# EasyEDA Pro project ProPrj_FOC_STM32F446.epro, schematic schematic1

## Sheets
1 电源: Board Name: Board1
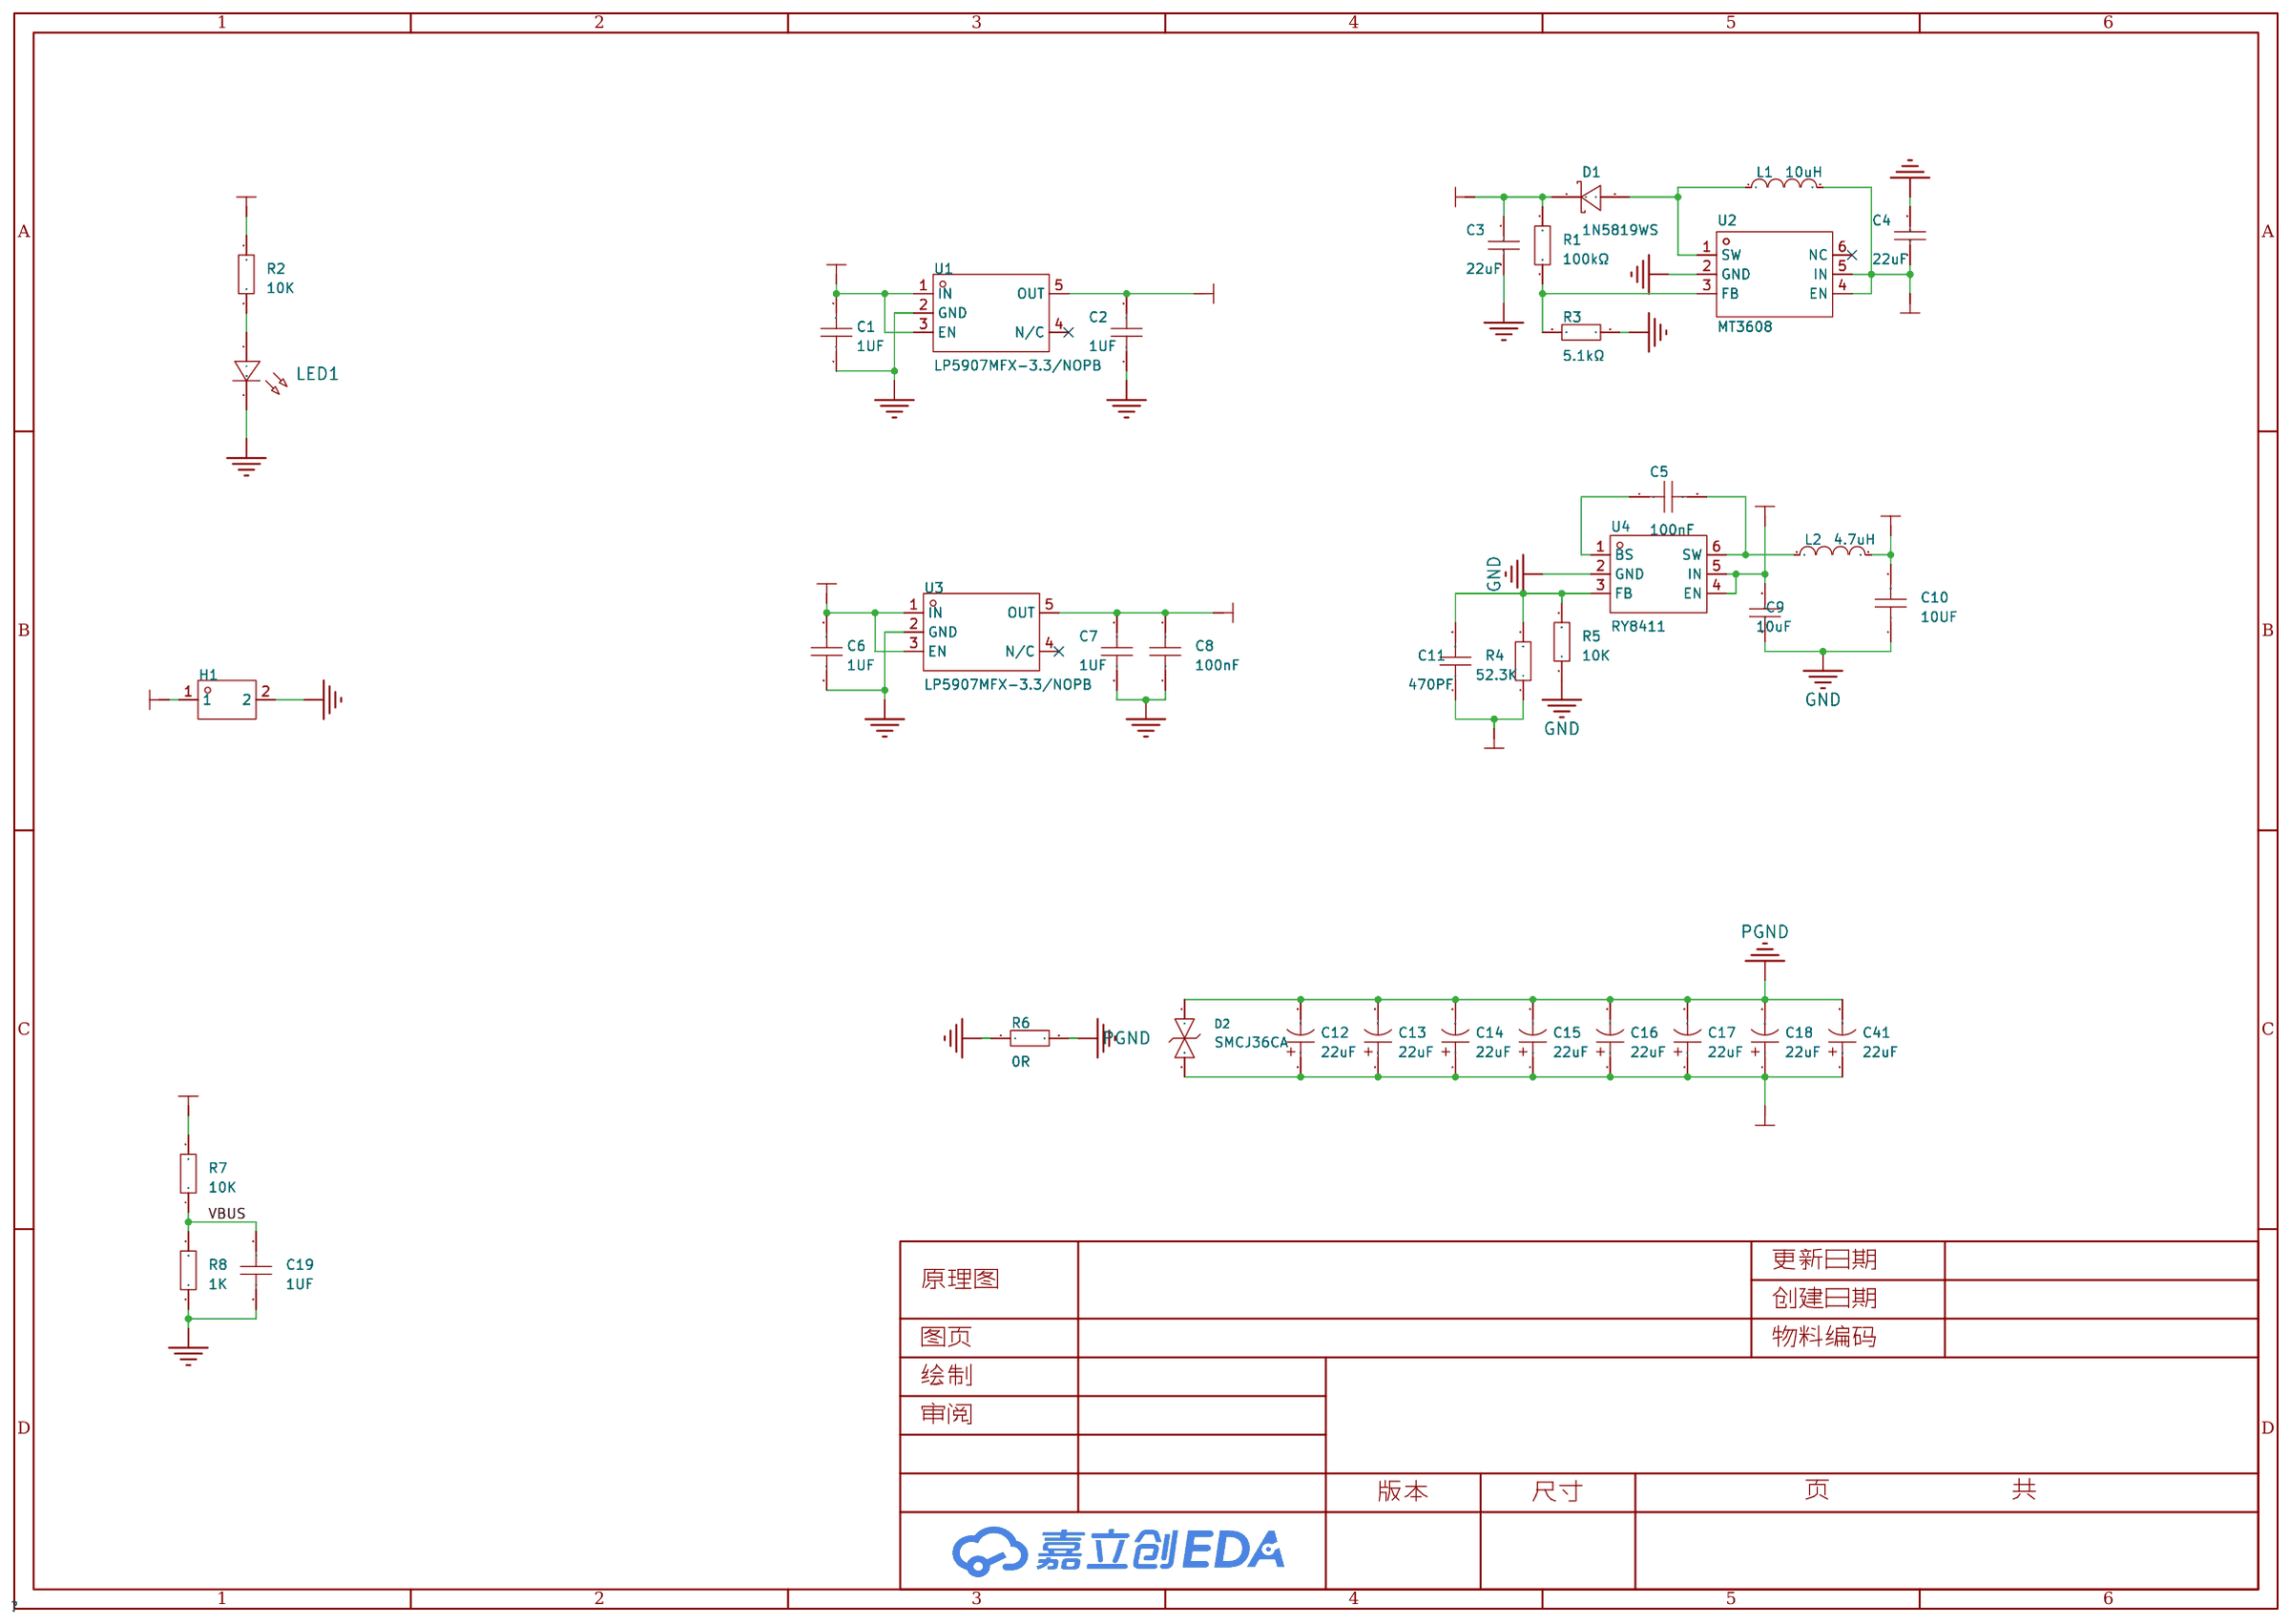
[diagram p0: 电源]
2 驱动: Create Date: 2023-12-28; Page Name: 驱动; Project Name: MY_FOC; Schematic Name: Schematic1; Update Date: 2024-01-11; Company: 嘉立创EDA; Page Size: A4; Version: V1.0
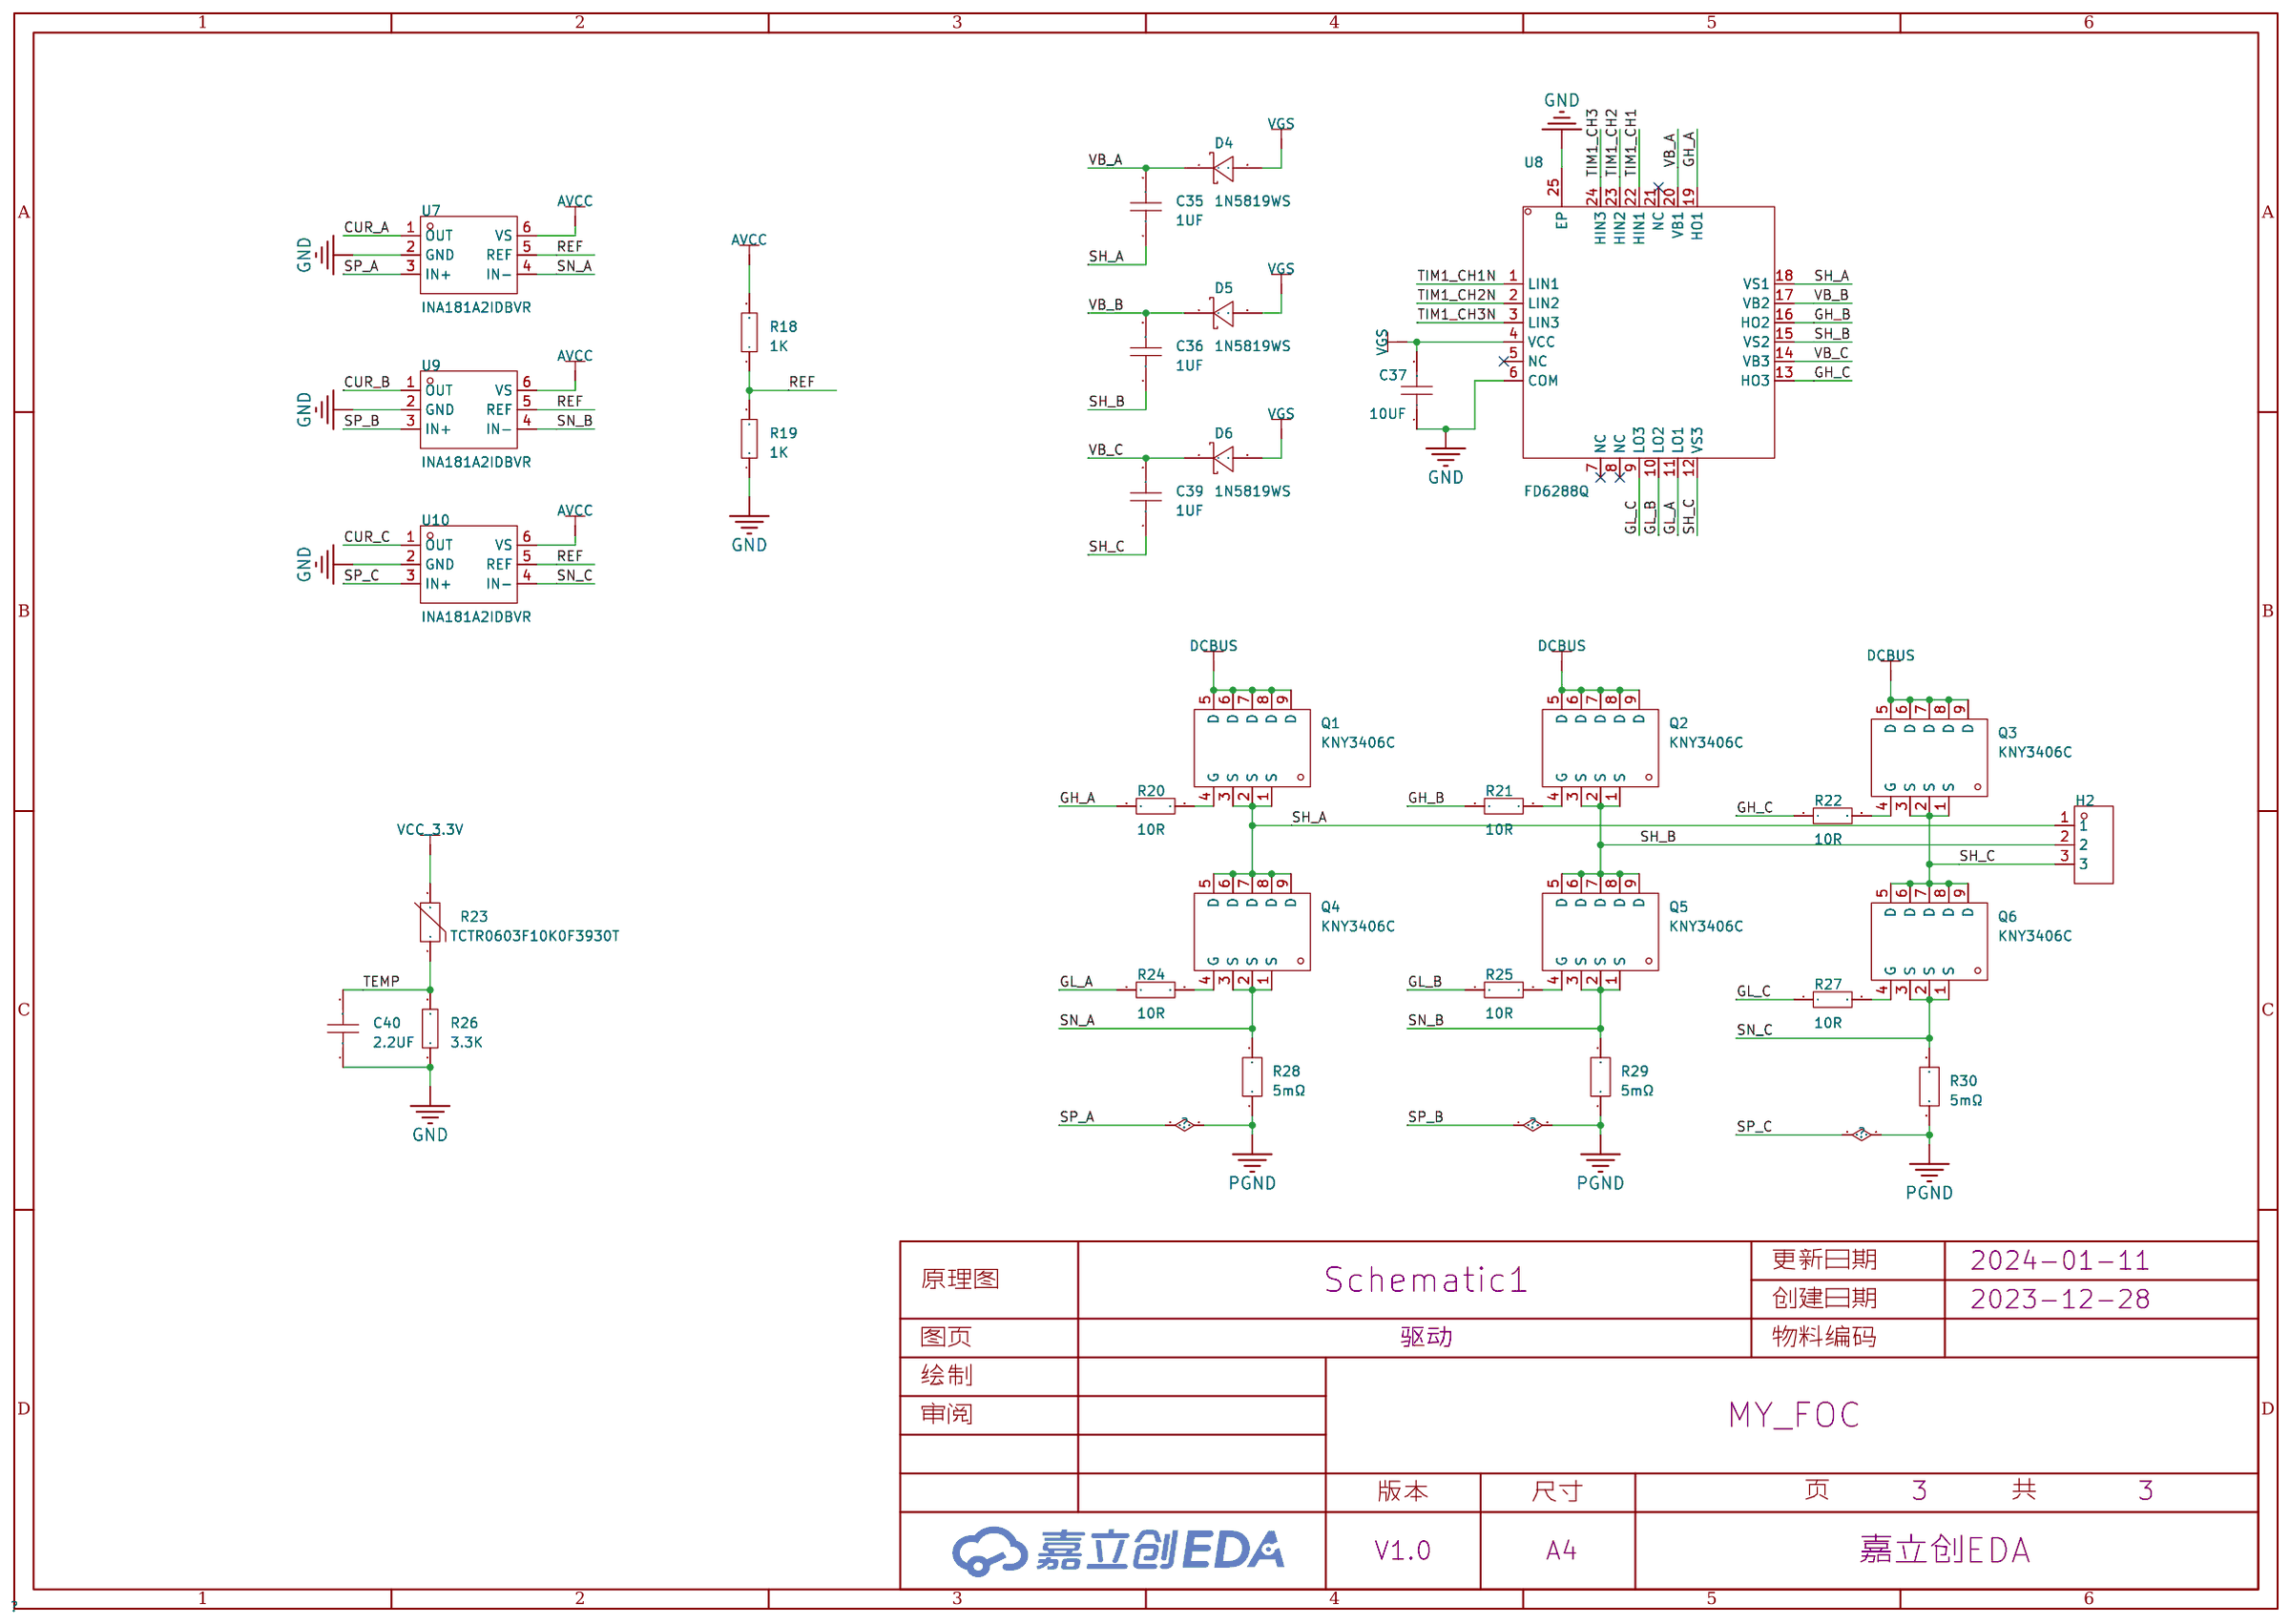
[diagram p1: 驱动]
3 主控: Create Date: 2023-12-28; Page Name: 主控; Project Name: MY_FOC; Schematic Name: Schematic1; Update Date: 2024-01-12; Company: 嘉立创EDA; Page Size: A4; Version: V1.0
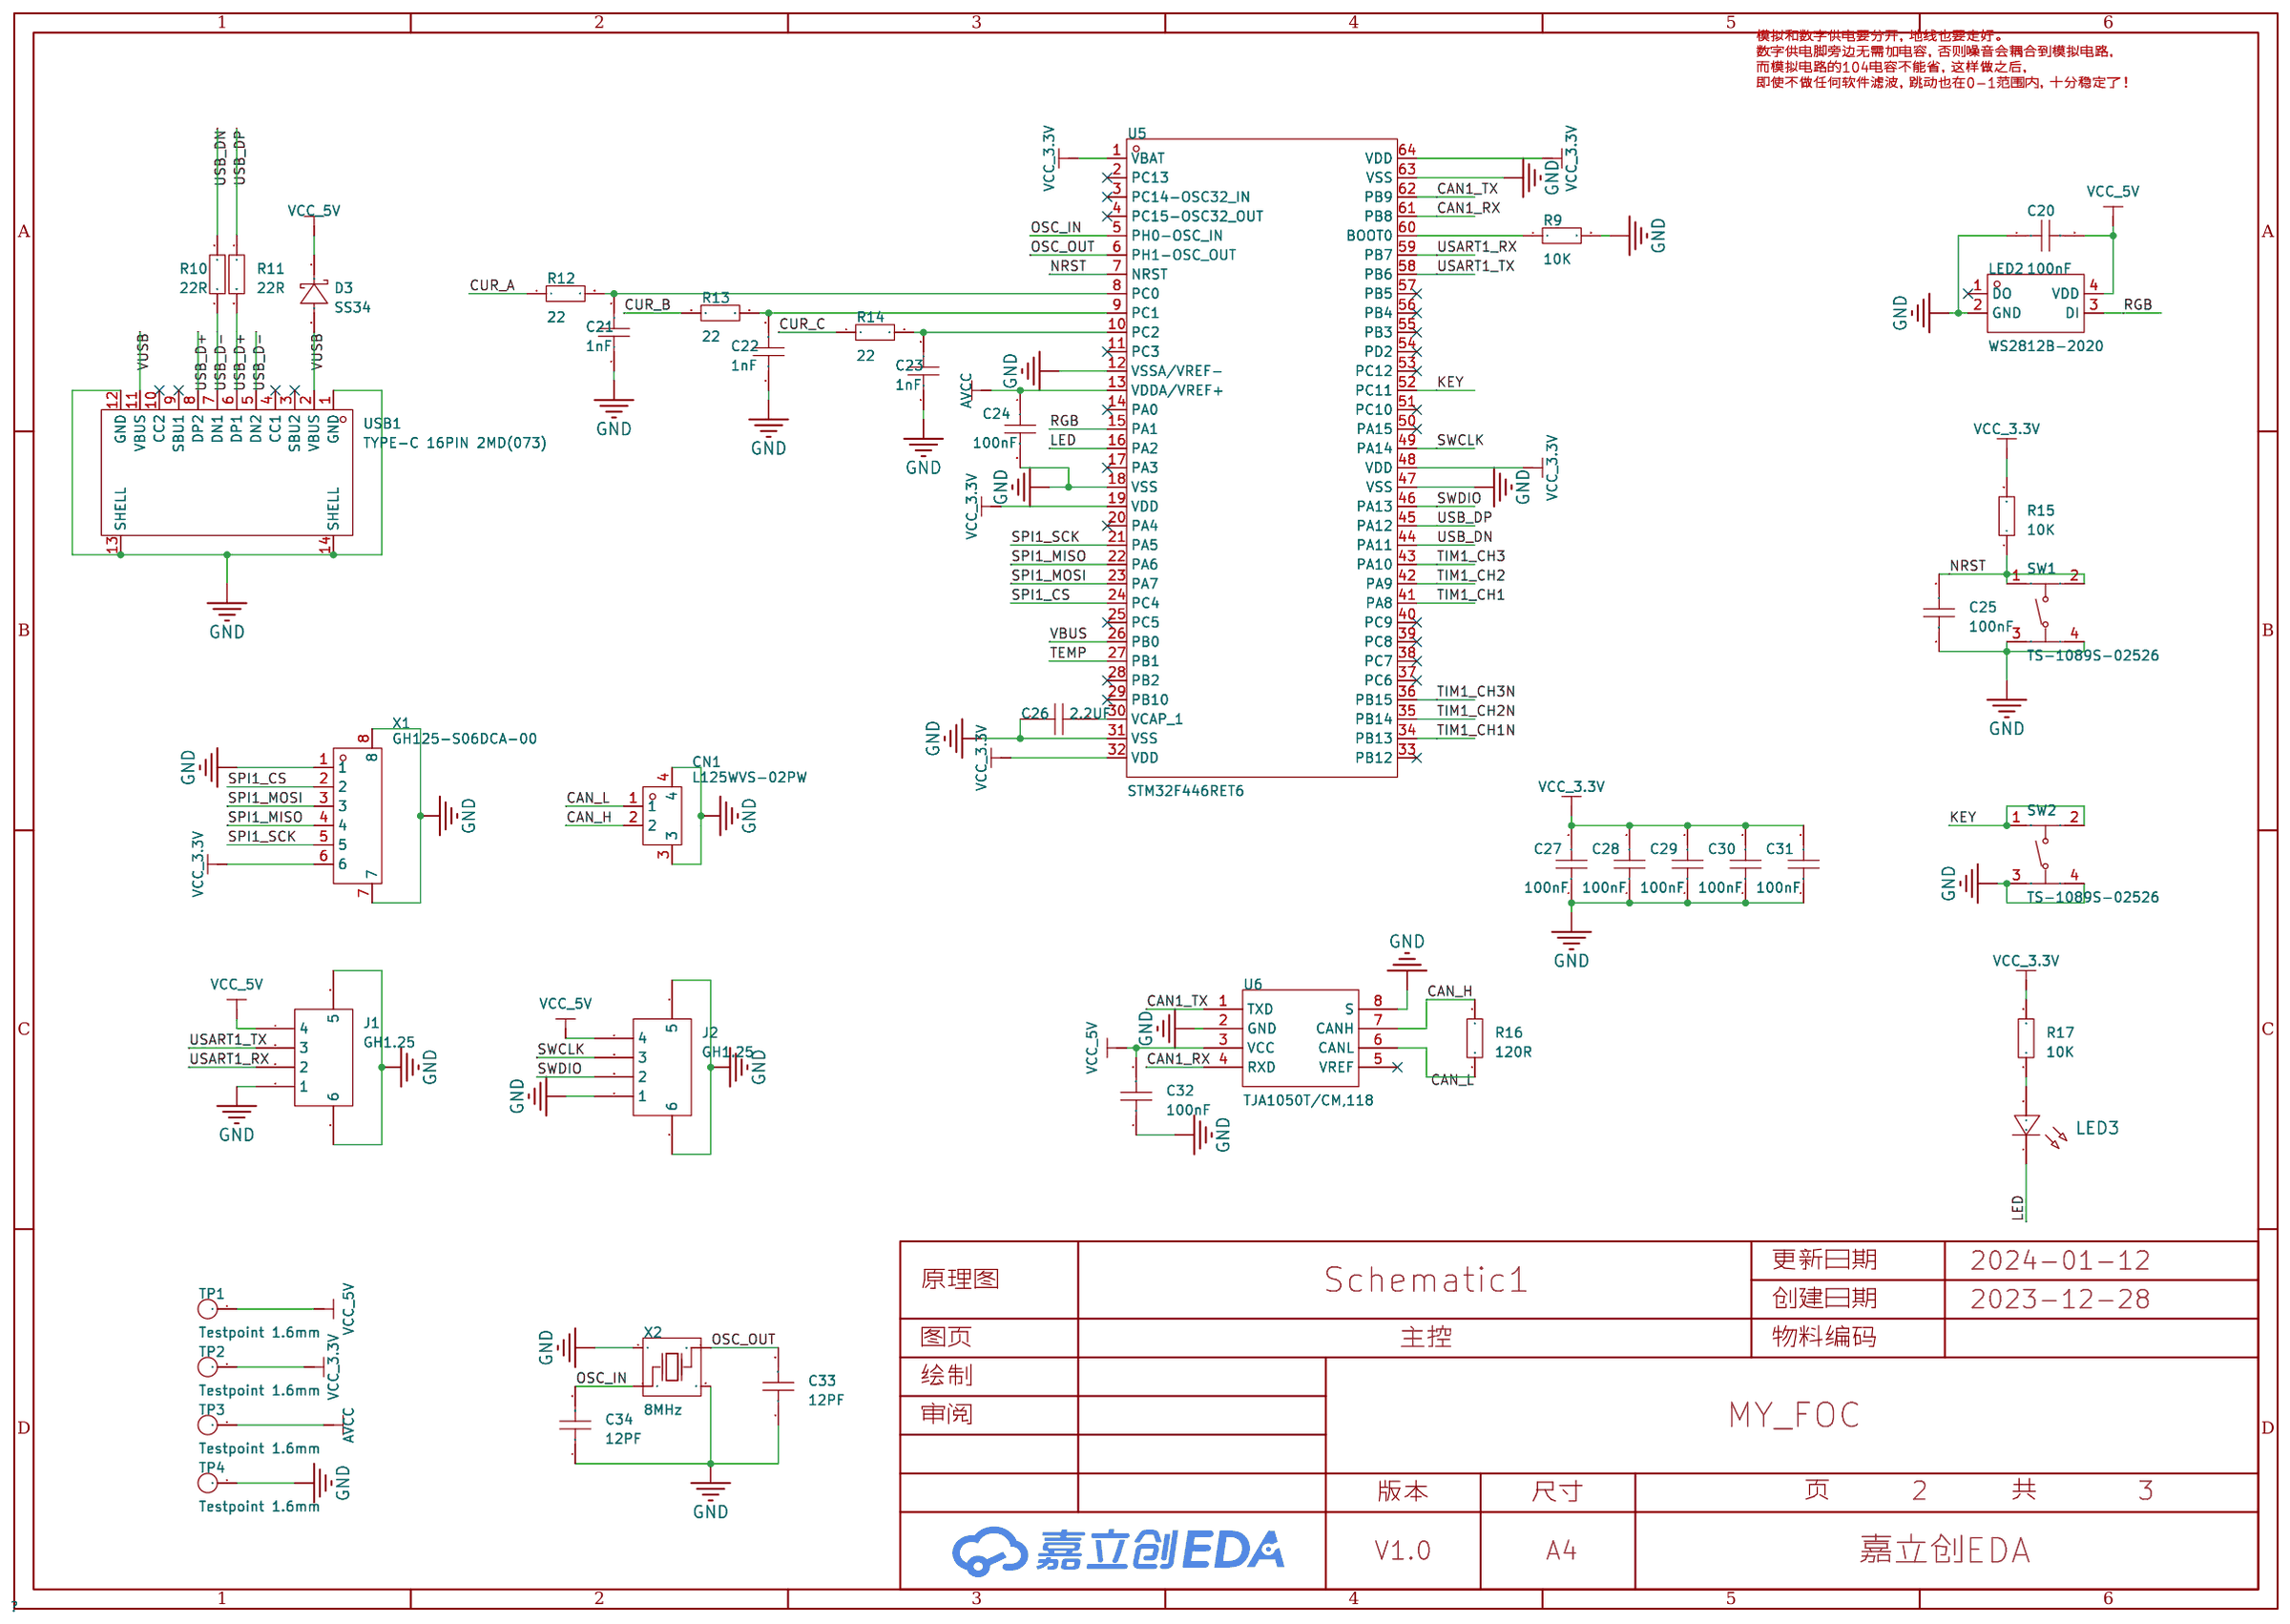
[diagram p2: 主控]

## Parts
sheet 主控
C20  100nF  [C0603]
C21  1nF  [C0603]
C22  1nF  [C0603]
C23  1nF  [C0603]
C24  100nF  [C0603]
C25  100nF  [C0603]
C26  2.2UF  [C0603]
C27  100nF  [C0603]
C28  100nF  [C0603]
C29  100nF  [C0603]
C30  100nF  [C0603]
C31  100nF  [C0603]
C32  100nF  [C0603]
C33  12PF  [C0603]
C34  12PF  [C0603]
CN1  L125WVS-02PW  [CONN-SMD_2P-P1.25_DELON_L125WVS-02PW]
D3  SS34  [SMA_L4.3-W2.5-LS5.0-RD]
J1  GH1.25  [CONN-SMD_4P-P1.25_JS_GH125-S04CCA-00]
J2  GH1.25  [CONN-SMD_4P-P1.25_JS_GH125-S04CCA-00]
LED2  WS2812B-2020  [LED-SMD_4P-L2.0-W2.0-TL_WS2812B-2020]
LED3  -  [LED_0603]
R9  10K  [R0603]
R10  22R  [R0603]
R11  22R  [R0603]
R12  22  [R0603]
R13  22  [R0603]
R14  22  [R0603]
R15  10K  [R0603]
R16  120R  [R0603]
R17  10K  [R0603]
SW1  TS-1089S-02526  [SW-SMD_4P-L4.2-W3.3-P2.15-LS5.1]
SW2  TS-1089S-02526  [SW-SMD_4P-L4.2-W3.3-P2.15-LS5.1]
TP1  Testpoint 1.6mm  [TESTPOINT 1.6MM]
TP2  Testpoint 1.6mm  [TESTPOINT 1.6MM]
TP3  Testpoint 1.6mm  [TESTPOINT 1.6MM]
TP4  Testpoint 1.6mm  [TESTPOINT 1.6MM]
U5  STM32F446RET6  [LQFP-64_L10.0-W10.0-P0.50-LS12.0-BL]
U6  TJA1050T/CM,118  [SOIC-8_L5.0-W4.0-P1.27-LS6.0-BL]
USB1  TYPE-C 16PIN 2MD(073)  [USB-C-SMD_TYPE-C-6PIN-2MD-073]
X1  GH125-S06DCA-00  [CONN-SMD_6P-P1.25_JUSHUO_GH125-S06DCA-00]
X2  8MHz  [OSC-SMD_4P-L3.2-W2.5-BL]
sheet 电源
C1  1UF  [C0603]
C2  1UF  [C0603]
C3  22uF  [C1206]
C4  22uF  [C1206]
C5  100nF  [C0603]
C6  1UF  [C0603]
C7  1UF  [C0603]
C8  100nF  [C0603]
C9  10uF  [C1206]
C10  10UF  [C0603]
C11  470PF  [C0603]
C12  22uF  [CAP-SMD_L3.2-W1.6-FD]
C13  22uF  [CAP-SMD_L3.2-W1.6-FD]
C14  22uF  [CAP-SMD_L3.2-W1.6-FD]
C15  22uF  [CAP-SMD_L3.2-W1.6-FD]
C16  22uF  [CAP-SMD_L3.2-W1.6-FD]
C17  22uF  [CAP-SMD_L3.2-W1.6-FD]
C18  22uF  [CAP-SMD_L3.2-W1.6-FD]
C19  1UF  [C0603]
C41  22uF  [CAP-SMD_L3.2-W1.6-FD]
D1  1N5819WS  [SOD-323_L1.8-W1.3-LS2.5-RD]
D2  SMCJ36CA  [SMC_L7.2-W5.8-LS8.1-BI]
H1  -  [HDR-TH_2P-P2.54-V-M-2]
L1  10uH  [IND-SMD_L2.5-W2.0_FNR252012S]
L2  4.7uH  [IND-SMD_L2.5-W2.0_FNR252012S]
LED1  -  [LED_0603]
R1  100kΩ  [R0603]
R2  10K  [R0603]
R3  5.1kΩ  [R0603]
R4  52.3K  [R0603]
R5  10K  [R0603]
R6  0R  [R0603]
R7  10K  [R0603]
R8  1K  [R0603]
U1  LP5907MFX-3.3/NOPB  [SOT-23-5_L3.0-W1.7-P0.95-LS2.8-BR]
U2  MT3608  [SOT-23-6_L2.9-W1.6-P0.95-LS2.8-BL]
U3  LP5907MFX-3.3/NOPB  [SOT-23-5_L3.0-W1.7-P0.95-LS2.8-BR]
U4  RY8411  [SOT-23-6_L2.9-W1.6-P0.95-LS2.8-TL]
sheet 驱动
C35  1UF  [C0603]
C36  1UF  [C0603]
C37  10UF  [C0603]
C39  1UF  [C0603]
C40  2.2UF  [C0603]
D4  1N5819WS  [SOD-323_L1.8-W1.3-LS2.5-RD]
D5  1N5819WS  [SOD-323_L1.8-W1.3-LS2.5-RD]
D6  1N5819WS  [SOD-323_L1.8-W1.3-LS2.5-RD]
H2  -  [HDR-TH_3P-P2.54-V-M]
Q1  KNY3406C  [PDFN-8_L4.9-W5.8-P1.27-LS6.1-BL]
Q2  KNY3406C  [PDFN-8_L4.9-W5.8-P1.27-LS6.1-BL]
Q3  KNY3406C  [PDFN-8_L4.9-W5.8-P1.27-LS6.1-BL]
Q4  KNY3406C  [PDFN-8_L4.9-W5.8-P1.27-LS6.1-BL]
Q5  KNY3406C  [PDFN-8_L4.9-W5.8-P1.27-LS6.1-BL]
Q6  KNY3406C  [PDFN-8_L4.9-W5.8-P1.27-LS6.1-BL]
R18  1K  [R0603]
R19  1K  [R0603]
R20  10R  [R0603]
R21  10R  [R0603]
R22  10R  [R0603]
R23  TCTR0603F10K0F3930T  [R0603]
R24  10R  [R0603]
R25  10R  [R0603]
R26  3.3K  [R0603]
R27  10R  [R0603]
R28  5mΩ  [RES-SMD_L6.4-W3.2-1]
R29  5mΩ  [RES-SMD_L6.4-W3.2-1]
R30  5mΩ  [RES-SMD_L6.4-W3.2-1]
U7  INA181A2IDBVR  [SOT-23-6_L2.9-W1.6-P0.95-LS2.8-BL]
U8  FD6288Q  [QFN-24_L4.0-W4.0-P0.50-BL-EP2.6]
U9  INA181A2IDBVR  [SOT-23-6_L2.9-W1.6-P0.95-LS2.8-BL]
U10  INA181A2IDBVR  [SOT-23-6_L2.9-W1.6-P0.95-LS2.8-BL]

## Library data of the parts
C1 C2 C5-C8 C10 C11 C19-C37 C39 C40 = CAP_0603: Supplier Footprint: 0603
CN1 = L125WVS-02PW: 插针结构:1x2P;间距:1.25mm;公母:公;安装方式:卧贴;排数:1;每排PIN数:2;额定电流:1A;工作温度范围:-40℃~+110℃;; LCSC Part Name: 1x2P 间距:1.25mm 卧贴 GH1.25间距卧式贴片 2P 连接器; Supplier Part: C2998790; Manufacturer: DEALON(德艺隆); Supplier Footprint: SMD,P=1.25mm; JLCPCB Part Class: 扩展库; Datasheet: https://atta.szlcsc.com/upload/public/pdf/source/20220425/50B09E6409C3A2782C6D65104D18E34A.pdf; Supplier: LCSC; Pins Structure: 1x2P; Pitch: 1.25mm; Gender: 公; Mounting Style: 卧贴; Number of Rows: 1; Number of PINs Per Row: 2; Current Rating (Max): 1A; Operating Temperature Range: -40℃~+110℃
D3 = SS34_C727060: 二极管配置:独立式;正向压降(Vf):550mV@3A;直流反向耐压(Vr):40V;平均整流电流(Io):3A;; LCSC Part Name: 电压:40V 电流:3A; Supplier Part: C727060; Manufacturer: TWGMC(台湾迪嘉); Supplier Footprint: SMA(DO-214AC); JLCPCB Part Class: 扩展库; Datasheet: https://atta.szlcsc.com/upload/public/pdf/source/20200828/C727059_6599B6CAC5F3238B9C33E46794659DBE.pdf; Supplier: LCSC; Diode Configuration: 独立式; Forward Voltage (Vf@If): 550mV@3A; Reverse Voltage (Vr): 40V; Average Rectified Current (Io): 3A; Reverse Leakage Current (Ir): 500uA@40V
J1 J2 = GH1.25
LED2 = WS2812B-2020: 发光颜色:RGB三色;二极管配置:-;功率:-;透镜颜色:-;主波长:470.4nm；622.5nm；515.6nm;色温:-;发光角度:-;安装方式:-;工作温度:-;; LCSC Part Name: RGB三色 （注意防潮，请查阅规格书中对应具体内容）; Supplier Part: C965555; Manufacturer: worldsemi; Supplier Footprint: SMD,2x2mm; JLCPCB Part Class: 扩展库; Datasheet: https://atta.szlcsc.com/upload/public/pdf/source/20201203/C965555_5C919C4B6231E6ADE06011FB0D94282B.pdf; Supplier: LCSC; Emitted Color: RGB三色; Forward Current: 12mA; Dominant Wavelength: 470.4nm；622.5nm；515.6nm
LED1 LED3 = LED_0603-R: Supplier Footprint: 0603
R2 R4-R22 R24-R27 = Res_0603: Supplier Footprint: 0603
SW1 SW2 = TS-1089S-02526: 触点电流:50mA;额定电压(DC):12V;电路结构:单刀单掷;安装方式:立贴;带灯:-;机械寿命:-;; LCSC Part Name: 4.2*3.25*2.5mm 立贴 轻触开关; Supplier Part: C455282; Manufacturer: XUNPU(讯普); Supplier Footprint: SMD,3.3x4.2mm; JLCPCB Part Class: 扩展库; Datasheet: https://atta.szlcsc.com/upload/public/pdf/source/20191118/C455282_2E86A26A9CC4FEF4662951C4D45ED672.pdf; Supplier: LCSC; Contact Current: 50mA; Voltage Rating (DC): 12V; Circuit: 单刀单掷; Mounting Style: 立贴; Actuator Style: 椭圆形按钮; Switch Length: 4.2mm; Switch Width: 3.25mm; Switch Height: 2.5mm
TP1-TP4 = Testpoint 1.6mm
U5 = STM32F446RET6: CPU内核:ARM Cortex-M4;CPU最大主频:180MHz;工作电压范围:1.7V~3.6V;程序存储容量:512KB;程序存储器类型:FLASH;RAM总容量:128KB;GPIO端口数量:50;; LCSC Part Name: STM32F446RET6 MSL=3; Supplier Part: C69336; Manufacturer: ST(意法半导体); Supplier Footprint: LQFP-64(10x10); JLCPCB Part Class: Extended Part; Datasheet: https://atta.szlcsc.com/upload/public/pdf/source/20170518/1495086068896.pdf; Supplier: LCSC; CPU Core: ARM Cortex-M4; CPU Maximum Speed: 180MHz; Operating Voltage Range: 1.7V~3.6V; Program Storage Size: 512KB; Program Memory Type: FLASH; RAM Size: 128KB; GPIO Ports Number: 50; ADC (Bit): 12bit; DAC (Bit): 12bit; Universal Serial Bus: 有; Peripheral/Function: PWM；PWM；低电压检测; Watchdog: 有; Infrared Data Association: 有; Low-Voltage Detect: 有; Direct Memory Access: 有; Internal Oscillator: 有; Operating Temperature Range: -40℃~+85℃
U6 = TJA1050T/CM,118: 类型:收发器;; LCSC Part Name: 4.75V~5.25V; Supplier Part: C6952; Manufacturer: NXP(恩智浦); Supplier Footprint: SOIC-8; JLCPCB Part Class: 扩展库; Datasheet: https://atta.szlcsc.com/upload/public/pdf/source/20140411/1457707042917.pdf; Supplier: LCSC; Type: 收发器; Supply Voltage: 4.75V~5.25V; Supply Current: 50mA
USB1 = TYPE-C 16PIN 2MD(073): 连接器类型:Type-C;标准:-;公母:母;触点数量:16P;端口数量:1;安装方式:卧贴;额定电流 - 电源:5A;工作温度范围:-25℃~+85℃;; LCSC Part Name: Type-C 母 卧贴 带定位柱 不锈钢外壳 2次模顶; Supplier Part: C2765186; Manufacturer: SHOU HAN(首韩); Supplier Footprint: SMD; JLCPCB Part Class: 扩展库; Datasheet: https://atta.szlcsc.com/upload/public/pdf/source/20211123/39B17C16241EAC15C5E277BDA434118E.pdf; Supplier: LCSC; Connector Type: Type-C; Gender: 母; Number of Contacts: 16P; Number of Ports: 1; Mounting Style: 卧贴; Current Rating - Power (Max): 5A; Operating Temperature Range: -25℃~+85℃
X1 = GH125-S06DCA-00: 插针结构:1x6P;间距:1.25mm;公母:公;安装方式:卧贴;行距:-;排数:1;每排PIN数:6;参考系列:GH;额定电流:1A;工作温度范围:-25℃~+85℃;; LCSC Part Name: 1x6P 间距:1.25mm 卧贴 系列:GH 带扣; Supplier Part: C2886769; Manufacturer: JS(钜硕电子); Supplier Footprint: SMD,P=1.25mm; JLCPCB Part Class: 扩展库; Datasheet: https://atta.szlcsc.com/upload/public/pdf/source/20210818/CD11791E5ED3EDF45A7009E9C8A2BD4C.pdf; Supplier: LCSC; Pins Structure: 1x6P; Pitch: 1.25mm; Gender: 公; Mounting Style: 卧贴; Number of Rows: 1; Number of PINs Per Row: 6; Reference Series: GH; Current Rating (Max): 1A; Operating Temperature Range: -25℃~+85℃
X2 = TAXM8M4RDBCCT2T: 频率:8MHz;频率公差:±10ppm;负载电容:10pF;; LCSC Part Name: 8MHz ±10ppm 10pF; Supplier Part: C400090; Manufacturer: TAE(雅晶鑫); Supplier Footprint: SMD3225-4P; JLCPCB Part Class: 扩展库; Datasheet: https://atta.szlcsc.com/upload/public/pdf/source/20190626/C400090_CF95B89E745AFE4EF2E392EF8AC009D6.pdf; Supplier: LCSC; Crystal Type: 贴片无源晶振; Frequency Tolerance: ±10ppm; Frequency Stability: ±15ppm; Load Capacitance: 10pF; Equivalent Series Resistance (ESR): 250Ω; Operating Temperature: -40℃~+85℃
C3 C4 = CL31A106KBHNNNE: 容值:10uF;精度:±10%;额定电压:50V;材质(温度系数):X5R;; LCSC Part Name: 10uF ±10% 50V; Supplier Part: C13585; Manufacturer: SAMSUNG(三星); Supplier Footprint: 1206; JLCPCB Part Class: 基础库; Datasheet: https://atta.szlcsc.com/upload/public/pdf/source/20160103/1457707668742.pdf; Supplier: LCSC; Tolerance: ±10%; Voltage Rated: 50V; Temperature Coefficient: X5R
C9 = CL31A106KBHNNNE: 容值:10uF;精度:±10%;额定电压:50V;材质(温度系数):X5R;; LCSC Part Name: 10uF ±10% 50V; Supplier Part: C13585; Manufacturer: SAMSUNG(三星); Supplier Footprint: 1206; JLCPCB Part Class: Basic Part; Datasheet: https://atta.szlcsc.com/upload/public/pdf/source/20160103/1457707668742.pdf; Supplier: LCSC; Tolerance: ±10%; Voltage Rated: 50V; Temperature Coefficient: X5R
C12-C18 C41 = T494A106K016AT: 容值:10uF;精度:±10%;额定电压:16V;等效串联电阻:3Ω;; LCSC Part Name: 10uF ±10% 16V; Supplier Part: C1952724; Manufacturer: KEMET(基美); Supplier Footprint: 1206; JLCPCB Part Class: 扩展库; Datasheet: https://atta.szlcsc.com/upload/public/pdf/source/20201117/C918865_2EC2324DB0DED54D3EF2ACC81798626D.pdf; Supplier: LCSC; Tolerance: ±10%; Rated Voltage: 16V; Equivalent Series Resistance(ESR): 3Ω; Operating Temperature: -55℃~+125℃
D1 D4-D6 = 1N5819WS_C191023: 正向压降(Vf):600mV@1A;直流反向耐压(Vr):40V;平均整流电流(Io):1A;; LCSC Part Name: 电压:40V 电流:1A; Supplier Part: C191023; Manufacturer: Hottech(合科泰); Supplier Footprint: SOD-323; JLCPCB Part Class: 基础库; Datasheet: https://atta.szlcsc.com/upload/public/pdf/source/20220428/3CB86FD8D28D653594B4E35F9D5AEFD9.pdf; Supplier: LCSC; Forward Voltage (Vf@If): 600mV@1A; Reverse Voltage (Vr): 40V; Average Rectified Current (Io): 1A
D2 = SMCJ36CA: 反向截止电压(Vrwm):36V;击穿电压:40V;最大钳位电压:58.1V;; Supplier Part: C782528; Manufacturer: SEMBO(深波); Supplier Footprint: SMC(DO-214AB); JLCPCB Part Class: 扩展库; Datasheet: https://atta.szlcsc.com/upload/public/pdf/source/20200915/C782492_975C6ECAFC7A34E9B5B5383186E515C9.pdf; Supplier: LCSC; Reverse Stand-Off Voltage (Vrwm): 36V; Breakdown Voltage: 40V; Reverse Leakage Current (Ir): 1uA; Peak Pulse Current (Ipp)@10/1000us: 25.9A; Maximum Clamping Voltage: 58.1V
H1 = HDR-M_2.54_2x1: Supplier Part: C2883961; Supplier Footprint: 插件,P=2.54mm
L1 L2 = FNR252012S220MT: 电感值:22uH;精度:±20%;额定电流:380mA;直流电阻(DCR):1.976Ω;; LCSC Part Name: 22uH ±20% 380mA 1.976Ω; Supplier Part: C167709; Manufacturer: cjiang(长江微电); Supplier Footprint: SMD; JLCPCB Part Class: Extended Part; Datasheet: https://atta.szlcsc.com/upload/public/pdf/source/20190327/C167709_4833153A6C5859FE5472BBE6A86A035C.pdf; Supplier: LCSC; Tolerance: ±20%; Rated Current: 380mA; DC Resistance (DCR): 1.976Ω
R1 R3 = AC0603FR-0710KL: 电阻类型:厚膜电阻;阻值:10kΩ;精度:±1%;功率:100mW;; LCSC Part Name: 10kΩ ±1% 100mW; Supplier Part: C116677; Manufacturer: YAGEO(国巨); Supplier Footprint: 0603; JLCPCB Part Class: 扩展库; Datasheet: https://atta.szlcsc.com/upload/public/pdf/source/20171106/C116677_15099694143531094015.pdf; Supplier: LCSC; Type: 厚膜电阻; Tolerance: ±1%; Power(Watts): 100mW; Temperature Coefficient: ±100ppm/℃; Overload Voltage (Max): 75V; Operating Temperature Range: -55℃~+155℃
U1 U3 = LP5907MFX-3.3/NOPB: 输出类型:固定;输出极性:正;最大输入电压:5.5V;输出电压:3.3V;输出电流:250mA;电源纹波抑制比(PSRR):90dB;; LCSC Part Name: 输入5.5V 输出3.3V 250mA; Supplier Part: C80670; Manufacturer: TI(德州仪器); Supplier Footprint: SOT-23-5; JLCPCB Part Class: 扩展库; Datasheet: https://www.ti.com/cn/lit/gpn/lp5907; Supplier: LCSC; Output Type: 固定; Output Polarity: 正; Number of Outputs: 1; Maximum Input Voltage: 5.5V; Output Voltage: 3.3V; Dropout Voltage: 250mV@(250mA); Quiescent Current (Ground Current): 25uA; Output Current: 250mA; Power Supply Rejection Ratio (PSRR): 90dB; Operating Temperature: -40℃~+125℃
U2 = MT3608: 功能类型:升压型;输入电压:2V~24V;输出电压:28V;输出电流(最大值):-;; LCSC Part Name: 升压型 输入2V~24V 输出28V; Supplier Part: C84817; Manufacturer: 西安航天民芯; Supplier Footprint: SOT-23-6; JLCPCB Part Class: 扩展库; Datasheet: https://atta.szlcsc.com/upload/public/pdf/source/20161110/1478743351706.pdf; Supplier: LCSC; Function: 升压型; Number of Outputs: 1; Topology: 升压式; Input Voltage: 2V~24V; Output Voltage: 28V; Switching Frequency: 1.2MHz
U4 = RY8411_C2935411: Supplier Part: C2935411; Manufacturer: RYCHiP(蕊源); Supplier Footprint: SOT-23-6; JLCPCB Part Class: Extended Part; Datasheet: https://atta.szlcsc.com/upload/public/pdf/source/20211220/DB2E518D79CF9F576C855DA4549CDE87.pdf; Supplier: LCSC
H2 = HDR-M_2.54_1x3P: Supplier Part: C2937625; Supplier Footprint: 插件
Q1-Q6 = KNY3406C: 类型:N沟道;漏源电压(Vdss):60V;连续漏极电流(Id):80A;功率(Pd):41W;导通电阻(RDS(on)@Vgs,Id):8.5mΩ@10V,10A;阈值电压(Vgs(th)@Id):2.5V@250uA;; LCSC Part Name: N沟道 60V 80A; Supplier Part: C455987; Manufacturer: KIA; Supplier Footprint: PDFN-8(5.8x4.9); JLCPCB Part Class: 扩展库; Datasheet: https://atta.szlcsc.com/upload/public/pdf/source/20191114/C455987_5B27682C33C31BB0F5A9BF4BAD1962A9.pdf; Supplier: LCSC; Type: N沟道; Drain Source Voltage (Vdss): 60V; Continuous Drain Current (Id): 80A; Power Dissipation (Pd): 41W; Drain Source On Resistance (RDS(on)@Vgs,Id): 8.5mΩ@10V,10A; Gate Threshold Voltage (Vgs(th)@Id): 2.5V@250uA
R23 = TCTR0603F10K0F3930T: 阻值(25℃):10kΩ;电阻精度:±1%;B值(25℃/50℃):3930K;功率:120mW;B值精度:±1%;最大稳态电流(25℃):-;; LCSC Part Name: 10kΩ 电阻精度:±1% 3930K; Supplier Part: C525383; Manufacturer: RESI(开步睿思）; Supplier Footprint: 0603; JLCPCB Part Class: 扩展库; Datasheet: https://atta.szlcsc.com/upload/public/pdf/source/20200506/C525364_82DA399420FD8342B6C8F2E2EC87328D.pdf; Supplier: LCSC; Resistance @ 25℃: 10kΩ; Resistance Tolerance: ±1%; B Constant (25℃/50℃): 3930K; Power: 120mW; B Constant Tolerance: ±1%; Operating Temperature: -40℃~+125℃
R28-R30 = RLP25FEGMR005: 电阻类型:采样电阻;阻值:5mΩ;精度:±1%;功率:3W;安装方式:贴片;; LCSC Part Name: 5mΩ ±1% 3W; Supplier Part: C393074; Manufacturer: 大毅科技; Supplier Footprint: 2512; JLCPCB Part Class: 扩展库; Datasheet: https://atta.szlcsc.com/upload/public/pdf/source/20190801/C393074_512E4A1FCC1F941D5D81F987E86D6968.pdf; Supplier: LCSC; Type: 采样电阻; Tolerance: ±1%; Power(Watts): 3W; Temperature Coefficient: ±50ppm/℃; Mounting Sytle: 贴片
U7 U9 U10 = INA181A2IDBVR: 26V、双向、350kHz 电流感应放大器 6-SOT-23 -40 to 125; Supplier Part: C2058784; Manufacturer: TI(德州仪器); Supplier Footprint: SOT-23-6; JLCPCB Part Class: 扩展库; Datasheet: https://atta.szlcsc.com/upload/public/pdf/source/20230221/837DBCE195DF399C65C32BF5ADC833C0.pdf; Supplier: LCSC
U8 = FD6288Q: Supplier Part: C328453; Manufacturer: Fortior Tech(峰岹); Supplier Footprint: QFN-24-EP(4x4); JLCPCB Part Class: 扩展库; Datasheet: https://atta.szlcsc.com/upload/public/pdf/source/20181108/C328453_785547738DB9FC0123219FC22539EFAD.pdf; Supplier: LCSC

## Nets
AVCC: C7.2 C8.2 C24.1 R18.2 TP3.1 U3.5(OUT) U5.13(VDDA/VREF+) U7.6(VS) U9.6(VS) U10.6(VS)
GND: C1.1 C2.1 C3.1 C4.2 C6.1 C7.1 C8.1 C9.1 C10.1 C19.1 C20.1 C21.1 C22.1 C23.1 C24.2 C25.1 C26.1 C27.1 C28.1 C29.1 C30.1 C31.1 C32.1 C33.1 C34.1 C37.1 C40.1 CN1.3 CN1.4 H1.2 J1.1 J1.5 J1.6 J2.1 J2.5 J2.6 LED1.1(C) LED2.2(GND) R3.1 R5.1 R6.1 R8.1 R9.2 R19.1 R26.1 SW1.3 SW1.4 SW2.3 SW2.4 TP4.1 U1.2(GND) U2.2(GND) U3.2(GND) U4.2(GND) U5.12(VSSA/VREF-) U5.18(VSS) U5.31(VSS) U5.47(VSS) U5.63(VSS) U6.2(GND) U6.8(S) U7.2(GND) U8.6(COM) U8.25(EP) U9.2(GND) U10.2(GND) USB1.1(GND) USB1.12(GND) USB1.13(SHELL) USB1.14(SHELL) X1.1 X1.7 X1.8 X2.2 X2.4
PGND: C12.2 C13.2 C14.2 C15.2 C16.2 C17.2 C18.2 C41.2 D2.1 R6.2 R28.1 R29.1 R30.1 U7.3(IN+) U9.3(IN+) U10.3(IN+)
VBUS: C19.2 R7.1 R8.2 U5.26(PB0)
VCC_3.3V: C2.2 C27.2 C28.2 C29.2 C30.2 C31.2 R2.1 R15.2 R17.2 R23.2 TP2.1 U1.5(OUT) U5.1(VBAT) U5.19(VDD) U5.32(VDD) U5.48(VDD) U5.64(VDD) X1.6
VCC_5V: C1.2 C4.1 C6.2 C10.2 C11.1 C20.2 C32.2 D3.1(C) J1.4 J2.4 L1.2 L2.2 LED2.4(VDD) R4.1 TP1.1 U1.1(IN) U1.3(EN) U2.4(EN) U2.5(IN) U3.1(IN) U3.3(EN) U6.3(VCC)
CAN1_RX: U5.61(PB8) U6.4(RXD)
CAN1_TX: U5.62(PB9) U6.1(TXD)
CAN_H: CN1.2 R16.2 U6.7(CANH)
CAN_L: CN1.1 R16.1 U6.6(CANL)
CUR_A: R12.1 U7.1(OUT)
CUR_B: R13.1 U9.1(OUT)
CUR_C: R14.1 U10.1(OUT)
DCBUS: C9.2 C12.1 C13.1 C14.1 C15.1 C16.1 C17.1 C18.1 C41.1 D2.2 H1.1 Q1.5(D) Q1.6(D) Q1.7(D) Q1.8(D) Q1.9(D) Q2.5(D) Q2.6(D) Q2.7(D) Q2.8(D) Q2.9(D) Q3.5(D) Q3.6(D) Q3.7(D) Q3.8(D) Q3.9(D) R7.2 U4.4(EN) U4.5(IN)
GH_A: R20.1 U8.19(HO1)
GH_B: R21.1 U8.16(HO2)
GH_C: R22.1 U8.13(HO3)
GL_A: R24.1 U8.11(LO1)
GL_B: R25.1 U8.10(LO2)
GL_C: R27.1 U8.9(LO3)
KEY: SW2.1 SW2.2 U5.52(PC11)
LED: LED3.1(C) U5.16(PA2)
NRST: C25.2 R15.1 SW1.1 SW1.2 U5.7(NRST)
OSC_IN: C34.2 U5.5(PH0-OSC_IN) X2.1
OSC_OUT: C33.2 U5.6(PH1-OSC_OUT) X2.3
REF: R18.1 R19.2 U7.5(REF) U9.5(REF) U10.5(REF)
RGB: LED2.3(DI) U5.15(PA1)
SH_A: C35.1 H2.1 Q1.1(S) Q1.2(S) Q1.3(S) Q4.5(D) Q4.6(D) Q4.7(D) Q4.8(D) Q4.9(D) U8.18(VS1)
SH_B: C36.1 H2.2 Q2.1(S) Q2.2(S) Q2.3(S) Q5.5(D) Q5.6(D) Q5.7(D) Q5.8(D) Q5.9(D) U8.15(VS2)
SH_C: C39.1 H2.3 Q3.1(S) Q3.2(S) Q3.3(S) Q6.5(D) Q6.6(D) Q6.7(D) Q6.8(D) Q6.9(D) U8.12(VS3)
SN_A: Q4.1(S) Q4.2(S) Q4.3(S) R28.2 U7.4(IN-)
SN_B: Q5.1(S) Q5.2(S) Q5.3(S) R29.2 U9.4(IN-)
SN_C: Q6.1(S) Q6.2(S) Q6.3(S) R30.2 U10.4(IN-)
SPI1_CS: U5.24(PC4) X1.2
SPI1_MISO: U5.22(PA6) X1.4
SPI1_MOSI: U5.23(PA7) X1.3
SPI1_SCK: U5.21(PA5) X1.5
SWCLK: J2.3 U5.49(PA14)
SWDIO: J2.2 U5.46(PA13)
TEMP: C40.2 R23.1 R26.2 U5.27(PB1)
TIM1_CH1: U5.41(PA8) U8.22(HIN1)
TIM1_CH1N: U5.34(PB13) U8.1(LIN1)
TIM1_CH2: U5.42(PA9) U8.23(HIN2)
TIM1_CH2N: U5.35(PB14) U8.2(LIN2)
TIM1_CH3: U5.43(PA10) U8.24(HIN3)
TIM1_CH3N: U5.36(PB15) U8.3(LIN3)
USART1_RX: J1.2 U5.59(PB7)
USART1_TX: J1.3 U5.58(PB6)
USB_D+: R11.2 USB1.6(DP1) USB1.8(DP2)
USB_D-: R10.2 USB1.5(DN2) USB1.7(DN1)
USB_DN: R10.1 U5.44(PA11)
USB_DP: R11.1 U5.45(PA12)
VB_A: C35.2 D4.1(K) U8.20(VB1)
VB_B: C36.2 D5.1(K) U8.17(VB2)
VB_C: C39.2 D6.1(K) U8.14(VB3)
VGS: C3.2 C37.2 D1.1(K) D4.2(A) D5.2(A) D6.2(A) R1.2 U8.4(VCC)
VUSB: D3.2(A) USB1.2(VBUS) USB1.11(VBUS)
$1N5380: R1.1 R3.2 U2.3(FB)
$1N5382: D1.2(A) L1.1 U2.1(SW)
$1N5911: C5.1 U4.1(BS)
$1N5913: C11.2 R4.2 R5.2 U4.3(FB)
$1N5917: C5.2 L2.1 U4.6(SW)
$1N6293: LED1.2(A) R2.2
$4N2117: Q1.4(G) R20.2
$4N2305: Q4.4(G) R24.2
$4N2829: Q2.4(G) R21.2
$4N2834: Q5.4(G) R25.2
$4N3102: Q3.4(G) R22.2
$4N3107: Q6.4(G) R27.2
$5N15035: C26.2 U5.30(VCAP_1)
$5N15318: LED3.2(A) R17.1
$5N16585: R9.1 U5.60(BOOT0)
$5N18370: C21.2 R12.2 U5.8(PC0)
$5N18378: C22.2 R13.2 U5.9(PC1)
$5N18386: C23.2 R14.2 U5.10(PC2)

Not connected (* = marked no-connect by the designer): LED2 1(DO)*; U1 4(N/C)*; U2 6(NC)*; U3 4(N/C)*; U5 2(PC13)* 3(PC14-OSC32_IN)* 4(PC15-OSC32_OUT)* 11(PC3)* 14(PA0)* 17(PA3)* 20(PA4)* 25(PC5)* 28(PB2)* 29(PB10)* 33(PB12)* 37(PC6)* 38(PC7)* 39(PC8)* 40(PC9)* 50(PA15)* 51(PC10)* 53(PC12)* 54(PD2)* 55(PB3)* 56(PB4)* 57(PB5)*; U6 5(VREF)*; U8 5(NC)* 7(NC)* 8(NC)* 21(NC)*; USB1 3(SBU2)* 4(CC1)* 9(SBU1)* 10(CC2)*

## Notes on the sheets
sheet 3
- 模拟和数字供电要分开，地线也要走好。
  数字供电脚旁边无需加电容，否则噪音会耦合到模拟电路，
  而模拟电路的104电容不能省，这样做之后，
  即使不做任何软件滤波，跳动也在0-1范围内，十分稳定了！
